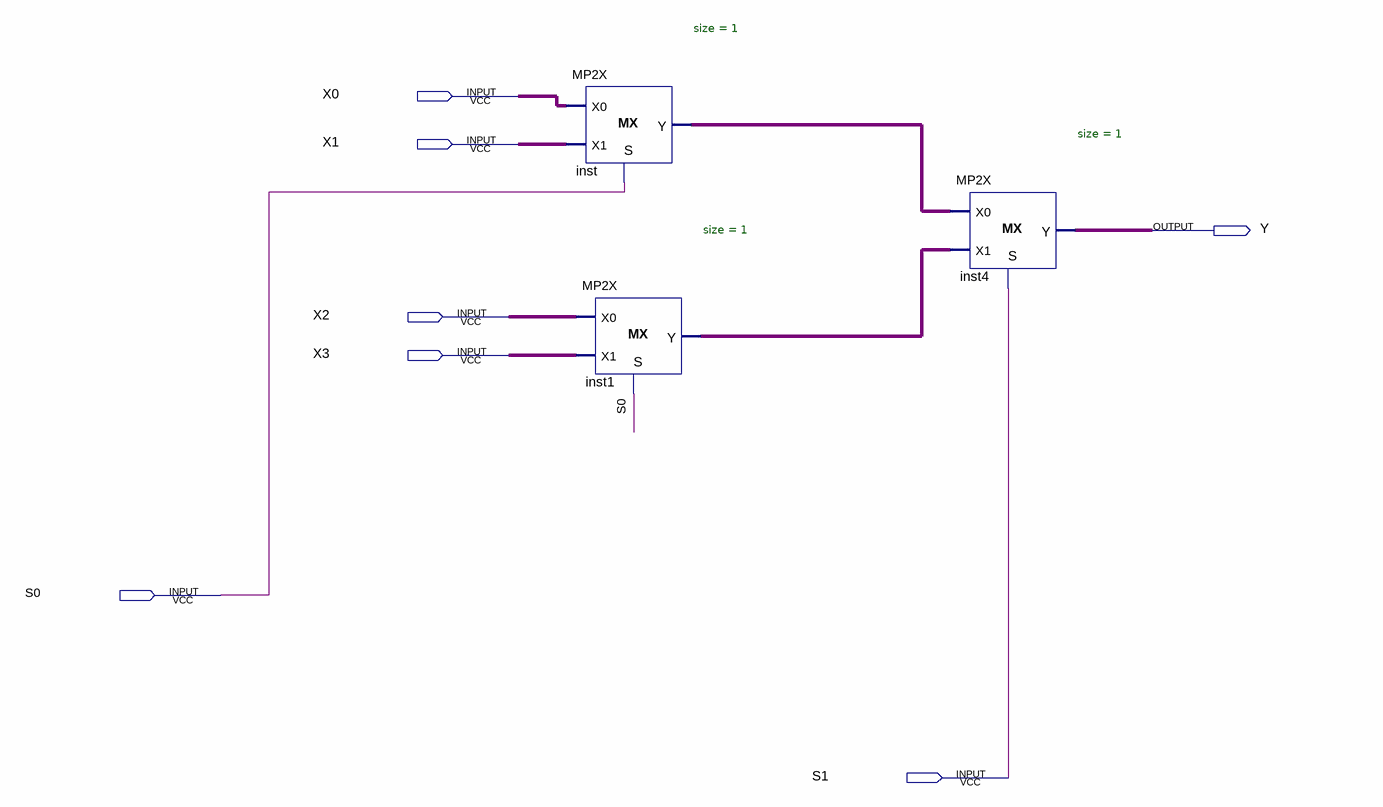
[diagram p0: schematic sheet]
// Quartus schematic MUX4_1_1b.bdf as structural Verilog: 3 symbols, 7 pins
module MUX4_1_1b (
  input  X0,
  input  X1,
  input  X2,
  input  X3,
  input  S0,
  input  S1,
  output Y
);

  wire inst1_y, inst_y;

  MP2X #(.size(1)) inst (.S(S0), .X0(X0), .X1(X1), .Y(inst_y));
  MP2X #(.size(1)) inst1 (.S(S0), .X0(X2), .X1(X3), .Y(inst1_y));
  MP2X #(.size(1)) inst4 (.S(S1), .X0(inst_y), .X1(inst1_y), .Y(Y));
endmodule
